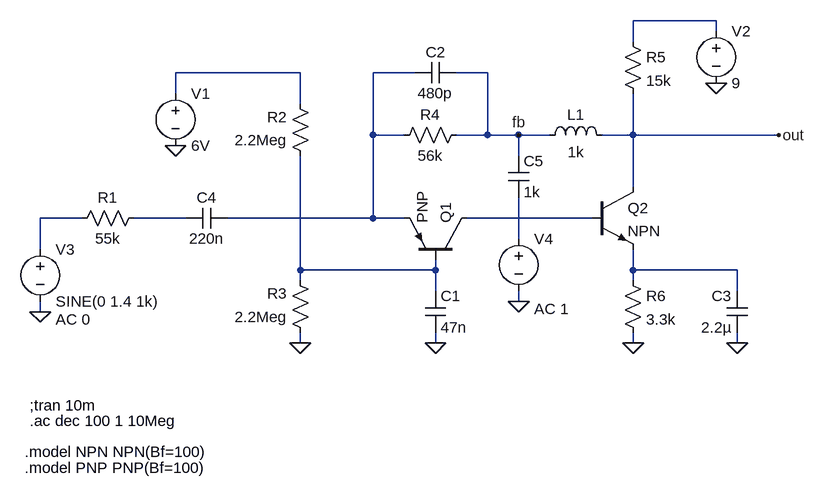
[diagram p0: schematic output.asc]
output.asc, the LTspice schematic file:
Version 4
SHEET 1 1220 680
WIRE 224 -384 96 -384
WIRE 224 -368 224 -384
WIRE 96 -352 96 -384
WIRE -416 -304 -608 -304
WIRE -240 -304 -304 -304
WIRE -128 -304 -176 -304
WIRE -608 -272 -608 -304
WIRE -416 -256 -416 -304
WIRE -304 -208 -304 -304
WIRE -256 -208 -304 -208
WIRE -128 -208 -128 -304
WIRE -128 -208 -176 -208
WIRE -80 -208 -128 -208
WIRE -32 -208 -80 -208
WIRE 96 -208 96 -272
WIRE 96 -208 48 -208
WIRE 320 -208 96 -208
WIRE -80 -176 -80 -208
WIRE 96 -128 96 -208
WIRE -752 -80 -816 -80
WIRE -592 -80 -672 -80
WIRE -304 -80 -304 -208
WIRE -304 -80 -528 -80
WIRE -256 -80 -304 -80
WIRE 32 -80 -160 -80
WIRE -80 -48 -80 -112
WIRE -816 -32 -816 -80
WIRE -416 0 -416 -176
WIRE -208 0 -208 -16
WIRE -208 0 -416 0
WIRE 96 0 96 -32
WIRE 256 0 96 0
WIRE -416 16 -416 0
WIRE 96 16 96 0
WIRE -208 32 -208 0
WIRE 256 32 256 0
WIRE -80 48 -80 32
WIRE -816 64 -816 48
WIRE -416 112 -416 96
WIRE -208 112 -208 96
WIRE 96 112 96 96
WIRE 256 112 256 96
FLAG -608 -192 0
FLAG 224 -288 0
FLAG -816 64 0
FLAG -416 112 0
FLAG -208 112 0
FLAG 96 112 0
FLAG 256 112 0
FLAG 320 -208 out
FLAG -80 -208 fb
FLAG -80 48 0
SYMBOL voltage -608 -288 R0
WINDOW 123 0 0 Left 0
WINDOW 39 0 0 Left 0
SYMATTR InstName V1
SYMATTR Value 6V
SYMBOL voltage 224 -384 R0
WINDOW 123 0 0 Left 0
WINDOW 39 0 0 Left 0
SYMATTR InstName V2
SYMATTR Value 9
SYMBOL voltage -816 -48 R0
WINDOW 123 24 124 Left 2
WINDOW 39 0 0 Left 0
SYMATTR Value2 AC 0
SYMATTR InstName V3
SYMATTR Value SINE(0 1.4 1k)
SYMBOL res -656 -96 R90
WINDOW 0 0 56 VBottom 2
WINDOW 3 32 56 VTop 2
SYMATTR InstName R1
SYMATTR Value 55k
SYMBOL res -400 -160 R180
WINDOW 0 36 76 Left 2
WINDOW 3 36 40 Left 2
SYMATTR InstName R2
SYMATTR Value 2.2Meg
SYMBOL res -400 112 R180
WINDOW 0 36 76 Left 2
WINDOW 3 36 40 Left 2
SYMATTR InstName R3
SYMATTR Value 2.2Meg
SYMBOL res -272 -192 R270
WINDOW 0 32 56 VTop 2
WINDOW 3 0 56 VBottom 2
SYMATTR InstName R4
SYMATTR Value 56k
SYMBOL res 80 -368 R0
SYMATTR InstName R5
SYMATTR Value 15k
SYMBOL res 80 0 R0
SYMATTR InstName R6
SYMATTR Value 3.3k
SYMBOL cap -224 32 R0
SYMATTR InstName C1
SYMATTR Value 47n
SYMBOL cap -176 -320 R90
WINDOW 0 0 32 VBottom 2
WINDOW 3 32 32 VTop 2
SYMATTR InstName C2
SYMATTR Value 480p
SYMBOL cap 272 96 R180
WINDOW 0 24 56 Left 2
WINDOW 3 24 8 Left 2
SYMATTR InstName C3
SYMATTR Value 2.2µ
SYMBOL pnp -160 -16 M270
SYMATTR InstName Q1
SYMBOL npn 32 -128 R0
SYMATTR InstName Q2
SYMBOL cap -528 -96 R90
WINDOW 0 0 32 VBottom 2
WINDOW 3 32 32 VTop 2
SYMATTR InstName C4
SYMATTR Value 220n
SYMBOL ind -48 -192 R270
WINDOW 0 32 56 VTop 2
WINDOW 3 5 56 VBottom 2
SYMATTR InstName L1
SYMATTR Value 1k
SYMBOL voltage -80 -64 R0
WINDOW 123 24 124 Left 2
WINDOW 39 0 0 Left 0
SYMATTR Value2 AC 1
SYMATTR InstName V4
SYMATTR Value ""
SYMBOL cap -96 -176 R0
SYMATTR InstName C5
SYMATTR Value 1k
TEXT -832 208 Left 2 !;tran 10m
TEXT -832 232 Left 2 !.ac dec 100 1 10Meg
TEXT -840 280 Left 2 !.model NPN NPN(Bf=100)
TEXT -840 304 Left 2 !.model PNP PNP(Bf=100)

The netlist it stands for:
* output.asc
V1 N002 0 6V
V2 N001 0 9
V3 N004 0 SINE(0 1.4 1k) AC 0
R1 N005 N004 55k
R2 N008 N002 2.2Meg
R3 0 N008 2.2Meg
R4 N003 fb 56k
R5 N001 out 15k
R6 N009 0 3.3k
C1 N008 0 47n
C2 fb N003 480p
C3 0 N009 2.2µ
Q1 N006 N008 N003 0 PNP
Q2 out N006 N009 0 NPN
C4 N003 N005 220n
L1 fb out 1k
V4 N007 0 AC 1
C5 fb N007 1k
.model NPN NPN
.model PNP PNP
.lib standard.bjt
;tran 10m
.ac dec 100 1 10Meg
.model NPN NPN(Bf=100)
.model PNP PNP(Bf=100)
.backanno
.end